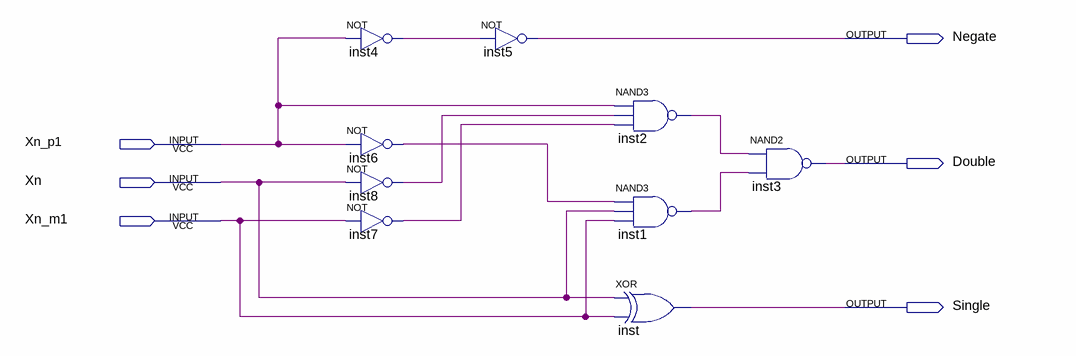
[diagram p0: schematic sheet]
// Quartus schematic MBE.bdf as structural Verilog: 9 symbols, 6 pins
module MBE (
  input  Xn_p1,
  input  Xn,
  input  Xn_m1,
  output Negate,
  output Double,
  output Single
);

  wire inst1_out, inst2_out, inst4_out, inst6_out, inst7_out, inst8_out;

  not inst4 (inst4_out, Xn_p1);
  not inst6 (inst6_out, Xn_p1);
  not inst8 (inst8_out, Xn);
  not inst7 (inst7_out, Xn_m1);
  not inst5 (Negate, inst4_out);
  nand inst2 (inst2_out, Xn_p1, inst8_out, inst7_out);
  nand inst1 (inst1_out, inst6_out, Xn, Xn_m1);
  xor inst (Single, Xn, Xn_m1);
  nand inst3 (Double, inst2_out, inst1_out);
endmodule
